# EAGLE design receiver_v2 (EAGLE 7.7.0)
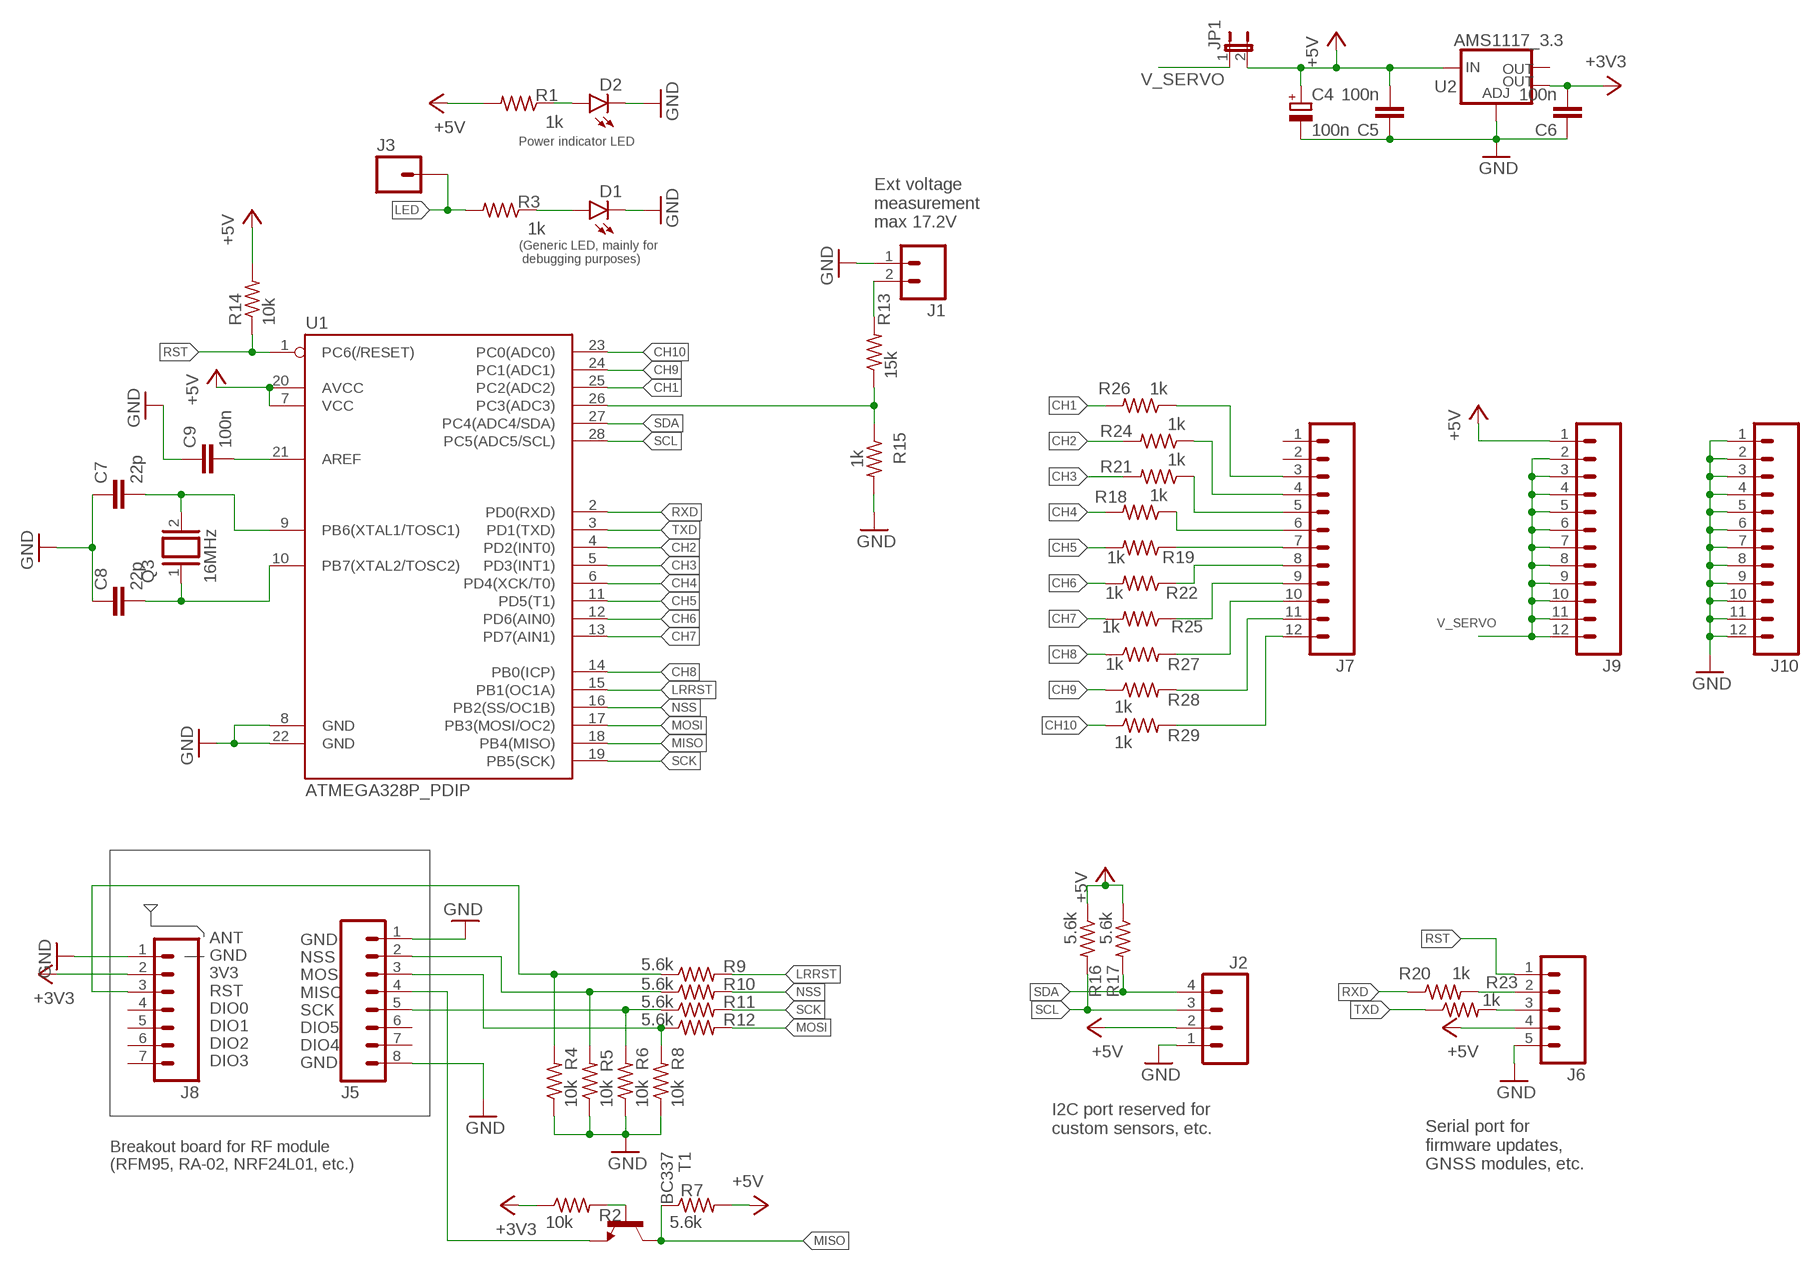
[diagram p0: schematic, sheet 1]

## Parts
C4  100n  CPOL-EUE2,5-6E  [E2,5-6E]
C5  100n  C-EU050-024X044  [C050-024X044]
C6  100n  C-EU050-024X044  [C050-024X044]
C7  22p  C-EU050-024X044  [C050-024X044]
C8  22p  C-EU050-024X044  [C050-024X044]
C9  100n  C-EU050-024X044  [C050-024X044]
D1  LED3MM  [LED3MM]
D2  LED3MM  [LED3MM]
J1  M02PTH  [1X02]
J2  M04PTH  [1X04]
J3  M01PTH  [1X01]
J5  M08  [1X08_ROUND]
J6  M05PTH  [1X05]
J7  M12PTH  [1X12]
J8  M07  [1X07]
J9  M12PTH  [1X12]
J10  M12PTH  [1X12]
JP1  JP1E  [JP1]
Q3  16MHz  XTAL/S  [QS]
R1  1k  R-US_0204/2V  [0204V]
R2  10k  R-US_0207/15  [0207/15]
R3  1k  R-US_0204/2V  [0204V]
R4  10k  R-US_0204/2V  [0204V]
R5  10k  R-US_0204/2V  [0204V]
R6  10k  R-US_0204/2V  [0204V]
R7  5.6k  R-US_0204/2V  [0204V]
R8  10k  R-US_0204/2V  [0204V]
R9  5.6k  R-US_0204/2V  [0204V]
R10  5.6k  R-US_0204/2V  [0204V]
R11  5.6k  R-US_0204/2V  [0204V]
R12  5.6k  R-US_0204/2V  [0204V]
R13  15k  R-US_0204/2V  [0204V]
R14  10k  R-US_0204/7  [0204/7]
R15  1k  R-US_0204/2V  [0204V]
R16  5.6k  R-US_0204/2V  [0204V]
R17  5.6k  R-US_0204/2V  [0204V]
R18  1k  R-US_0204/2V  [0204V]
R19  1k  R-US_0204/2V  [0204V]
R20  1k  R-US_0204/7  [0204/7]
R21  1k  R-US_0204/2V  [0204V]
R22  1k  R-US_0204/2V  [0204V]
R23  1k  R-US_0204/7  [0204/7]
R24  1k  R-US_0204/2V  [0204V]
R25  1k  R-US_0204/2V  [0204V]
R26  1k  R-US_0204/2V  [0204V]
R27  1k  R-US_0204/2V  [0204V]
R28  1k  R-US_0204/2V  [0204V]
R29  1k  R-US_0204/2V  [0204V]
T1  BC337  [TO92]
U1  ATMEGA328P_PDIP  [DIL28-3]
U2  AMS1117_3.3  V_REG_LM1117SOT223  [SOT223]

## Nets
+3V3: C6.2 J8.2 R2.1 U2.4(OUT)
+5V: C4.+ C5.2 J2.2 J6.4 J9.1 JP1.2 R1.2 R7.2 R14.2 R16.1 R17.1 U1.7(VCC) U1.20(AVCC) U2.3(IN)
CH1: R26.2 U1.25(PC2(ADC2))
CH2: R24.2 U1.4(PD2(INT0))
CH3: R21.2 U1.5(PD3(INT1))
CH4: R18.2 U1.6(PD4(XCK/T0))
CH5: R19.2 U1.11(PD5(T1))
CH6: R22.2 U1.12(PD6(AIN0))
CH7: R25.2 U1.13(PD7(AIN1))
CH8: R27.1 U1.14(PB0(ICP))
CH9: R28.1 U1.24(PC1(ADC1))
CH10: R29.1 U1.23(PC0(ADC0))
GND: C4.- C5.1 C6.1 C7.1 C8.1 C9.1 D1.K(C) D2.K(C) J1.1 J2.1 J5.1 J5.8 J6.5 J8.1 J10.1 J10.2 J10.3 J10.4 J10.5 J10.6 J10.7 J10.8 J10.9 J10.10 J10.11 J10.12 R4.1 R5.1 R6.1 R8.1 R15.2 U1.8(GND) U1.22(GND) U2.1(ADJ)
LED: J3.1 R3.2
LRRST: R9.2 U1.15(PB1(OC1A))
MISO: R7.1 T1.3(C) U1.18(PB4(MISO))
MOSI: R12.2 U1.17(PB3(MOSI/OC2))
N$1: D2.A R1.1
N$2: J7.11 R28.2
N$3: J5.4 T1.1(E)
N$4: J7.10 R27.2
N$6: J8.3 R4.2 R9.1
N$7: J5.2 R5.2 R10.1
N$8: J5.5 R6.2 R11.1
N$9: J5.3 R8.2 R12.1
N$10: C9.2 U1.21(AREF)
N$13: R13.1 R15.1 U1.26(PC3(ADC3))
N$14: J6.3 R23.2
N$15: D1.A R3.1
N$17: C7.2 Q3.2 U1.9(PB6(XTAL1/TOSC1))
N$18: J7.3 R26.1
N$19: C8.2 Q3.1 U1.10(PB7(XTAL2/TOSC2))
N$21: J6.2 R20.2
N$22: J7.4 R24.1
N$24: J7.5 R21.1
N$26: J7.6 R18.1
N$28: J7.7 R19.1
N$30: J7.8 R22.1
N$32: J7.9 R25.1
N$33: R2.2 T1.2(B)
N$35: J1.2 R13.2
N$40: J7.12 R29.2
NSS: R10.2 U1.16(PB2(SS/OC1B))
RST: J6.1 R14.1 U1.1(PC6(/RESET))
RXD: R20.1 U1.2(PD0(RXD))
SCK: R11.2 U1.19(PB5(SCK))
SCL: J2.3 R16.2 U1.28(PC5(ADC5/SCL))
SDA: J2.4 R17.2 U1.27(PC4(ADC4/SDA))
TXD: R23.1 U1.3(PD1(TXD))
V_SERVO: J9.2 J9.3 J9.4 J9.5 J9.6 J9.7 J9.8 J9.9 J9.10 J9.11 J9.12 JP1.1
Unconnected: J5.6 J5.7 J7.1 J7.2 J8.4 J8.5 J8.6 J8.7 U2.2(OUT)

## Notes on the sheet
- Power indicator LED
- Ext voltage 
  measurement
  max 17.2V
- (Generic LED, mainly for
   debugging purposes)
- ANT
  GND
  3V3
  RST
  DIO0
  DIO1
  DIO2
  DIO3
- GND
  NSS
  MOSI
  MISO
  SCK
  DIO5
  DIO4
  GND
- I2C port reserved for
  custom sensors, etc.
- Serial port for
  firmware updates,
  GNSS modules, etc.
- Breakout board for RF module
  (RFM95, RA-02, NRF24L01, etc.)

## Library data of the parts
C4 = rcl:CPOL-EU: POLARIZED CAPACITOR, European symbol
C5-C9 = rcl:C-EU: CAPACITOR, European symbol
D1 D2 = SparkFun-LED:LED: LEDs Standard schematic elements and footprints for 5mm, 3mm, 1206, and 0603 sized LEDs. 5mm - Spark Fun Electronics SKU : COM-00529 (and others); PROD_ID: DIO-08794
J1 = SparkFun-Connectors:M02: Standard 2-pin 0.1" header. Use with - straight break away headers ( PRT-00116) - right angle break away headers (PRT-00553) - swiss pins (PRT-00743) - machine pins (PRT-00117) - female headers (PRT-00115) Molex polarized connector foot print use with: PRT-08233 with associated crimp pins and housings. 2.54_SCREWTERM for use with PRT-10571. 3.5mm Screw Terminal footprints for PRT-08084 5mm Screw Terminal footprints for use with PRT-08432
J2 = SparkFun-Connectors:M04: Header 4 Standard 4-pin 0.1" header. Use with straight break away headers (SKU : PRT-00116), right angle break away headers (PRT-00553), swiss pins (PRT-00743), machine pins (PRT-00117), and female headers (PRT-00115). Molex polarized connector foot print use with SKU : PRT-08231 with associated crimp pins and housings. 1MM SMD Version SKU: PRT-10208; PROD_ID: CONN-09696
J3 = SparkFun-Connectors:M01: Header 1 Standard 1-pin 0.1" header. Use with straight break away headers (SKU : PRT-00116), right angle break away headers (PRT-00553), swiss pins (PRT-00743), machine pins (PRT-00117), and female headers (PRT-00115). SMTSO-256-ET is a "flush mount" nut for a 4-40 screw. The older package used to be too tight, and did not allow it to sit properly thru the drill hit. The latest (0.165DIA) fits nice and snug.
J5 = SparkFun-Connectors:M08: Header 8 Standard 8-pin 0.1" header. Use with straight break away headers (SKU : PRT-00116), right angle break away headers (PRT-00553), swiss pins (PRT-00743), machine pins (PRT-00117), and female headers (PRT-00115).; PROD_ID: CONN-08437
J6 = SparkFun-Connectors:M05: Header 5 Standard 5-pin 0.1" header. Use with straight break away headers (SKU : PRT-00116), right angle break away headers (PRT-00553), swiss pins (PRT-00743), machine pins (PRT-00117), and female headers (PRT-00115). Molex polarized connector foot print use with SKU : PRT-08230 with associated crimp pins and housings.
J7 J9 J10 = SparkFun-Connectors:M12: Header 12 Standard 12-pin 0.1" header. Use with straight break away headers (SKU : PRT-00116), right angle break away headers (PRT-00553), swiss pins (PRT-00743), machine pins (PRT-00117), and female headers (PRT-00115).
J8 = SparkFun-Connectors:M07: Header 7 Standard 7-pin 0.1" header. Use with straight break away headers (SKU : PRT-00116), right angle break away headers (PRT-00553), swiss pins (PRT-00743), machine pins (PRT-00117), and female headers (PRT-00115). NOTES ON THE VARIANTS LOCK and LOCK_LONGPADS... This footprint was designed to help hold the alignment of a through-hole component (i.e. 7-pin header) while soldering it into place. You may notice that each hole has been shifted either up or down by 0.005 of an inch from it's more standard position (which is usually a perfectly straight line). This slight alteration caused the pins (the squares in the middle) to touch the edges of the holes. Because they are alternating, it causes a "brace" to hold the header in place. 0.005 has proven to be the perfect amount of "off-center" position when using our standard breakaway headers. Although looks a little odd when you look at the bare footprint, once you have a header in there, the alteration is very hard to notice. Also, if you push a header all the way into place, it is covered up entirely on the bottom side. This idea of altering the position of holes to aid alignment will be further integrated into the Sparkfun Library for other footprints. It can help hold any component with 3 or more connection pins.
JP1 = jumper:JP1E: JUMPER
Q3 = special:XTAL/S: CRYSTAL
R1-R29 = rcl:R-US_: RESISTOR, American symbol
T1 = transistor:BC337: NPN TRANSISTOR
U1 = SparkFun-DigitalIC:ATMEGA328P_PDIP: uC used in the Arduino 32kb flash, 1k EEPROM, 2k SRAM This is the through-hole version of this chip.
U2 = SparkFun-PowerIC:V_REG_LM1117: Voltage Regulator LM1117 Standard adjustable voltage regulator but in SMD form. Spark Fun Electronics SKU : COM-00595; PROD_ID: VREG-08170

## Net classes
1 rf: clearance 0.5 mm

## Board
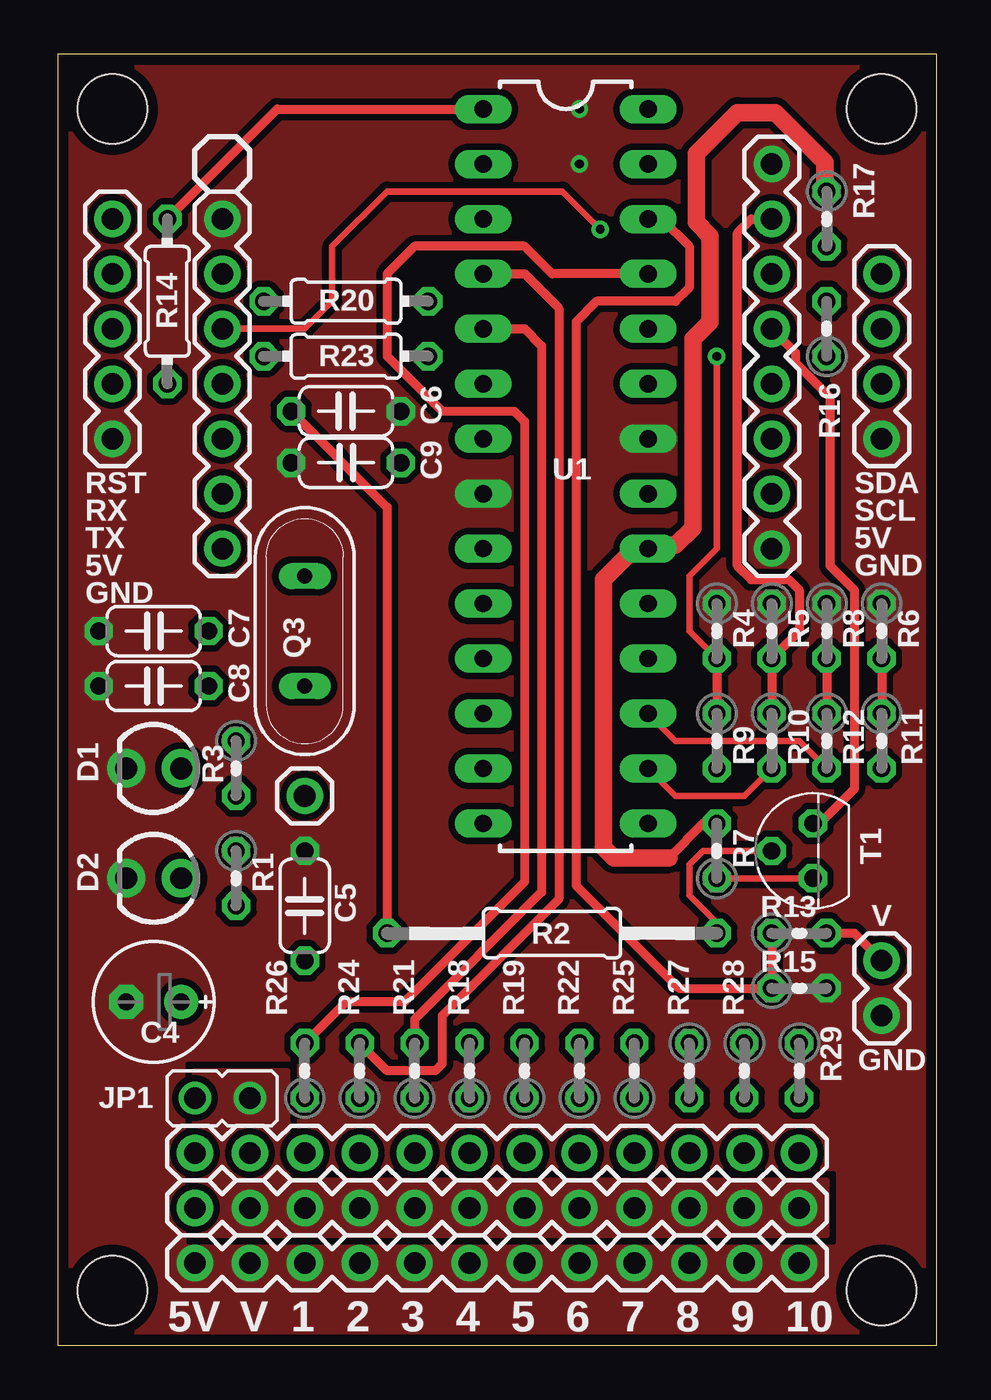
[diagram p1: board, top side]
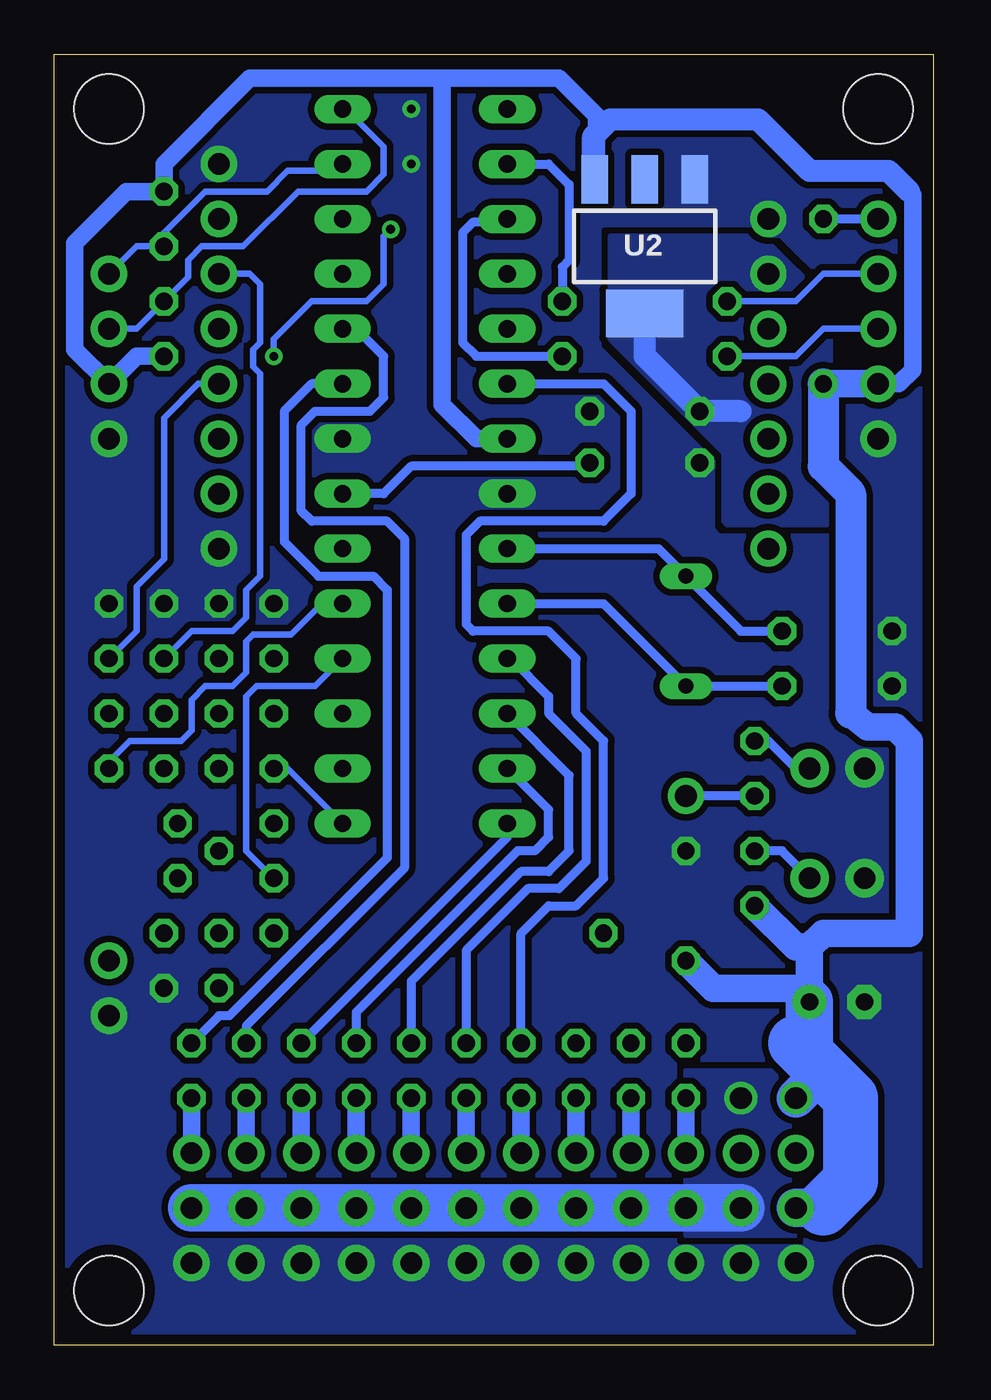
[diagram p2: board, bottom side, seen from below]

Size 40.64 x 59.69 mm. Coordinates in mm from the lower left corner, seen from the top.
Outline: 40.64,0 40.64,59.69 0,59.69 0,0 40.64,0
Copper layers (1*16): Top 0.035mm / dielectric 1.5mm / Bottom 0.035mm
Design rules "default *": minimum track width 10mil, minimum drill 0.4mm, track to track 0.3mm, track to pad 0.3mm, pad to pad 0.3mm, via to via 0.3mm, smd to smd 8mil, copper to edge 0.5mm, drill to drill 8mil, minimum pad ring 10mil, minimum via ring 8mil, stop-mask expansion 4mil, vias tented up to drill 0.8mm, thermal gap 10mil
Holes 3.2 mm at 2.54,57.15 38.1,57.15 2.54,2.54 38.1,2.54

### Footprints (pad centres in the part's own frame; a part is rotated, then mirrored left to right if it is on the bottom)
E2,5-6E = drill 0.8 pad 1.575: + -1.27,0 | drill 0.8 pad 1.575 octagon: - 1.27,0
C050-024X044 = drill 0.8 octagon: 1 -2.54,0; 2 2.54,0
LED3MM = drill 1 pad 1.778: A -1.27,0; K 1.27,0
1X02 = drill 1 pad 1.676: 1 0,0; 2 2.54,0
1X04 = drill 1 pad 1.676: 1 0,0; 2 2.54,0; 3 5.08,0; 4 7.62,0
1X01 = drill 1.016 pad 1.676: 1 0,0
1X08_ROUND = drill 1 pad 1.676: 1 0,0; 2 2.54,0; 3 5.08,0; 4 7.62,0; 5 10.16,0; 6 12.7,0; 7 15.24,0; 8 17.78,0
1X05 = drill 1 pad 1.676: 1 0,0; 2 2.54,0; 3 5.08,0; 4 7.62,0; 5 10.16,0
1X12 = drill 1 pad 1.676: 1 0,0; 2 2.54,0; 3 5.08,0; 4 7.62,0; 5 10.16,0; 6 12.7,0; 7 15.24,0; 8 17.78,0; 9 20.32,0; 10 22.86,0; 11 25.4,0; 12 27.94,0
1X07 = drill 1 pad 1.676: 1 0,0; 2 2.54,0; 3 5.08,0; 4 7.62,0; 5 10.16,0; 6 12.7,0; 7 15.24,0
JP1 = drill 1: 1 0,-1.27; 2 0,1.27
QS = drill 0.7 pad 1.016 long: 1 -2.54,0; 2 2.54,0
0204V = drill 0.8 octagon: 1 -1.27,0; 2 1.27,0
0207/15 = drill 0.8 octagon: 1 -7.62,0; 2 7.62,0
0204/7 = drill 0.8 octagon: 1 -3.81,0; 2 3.81,0
TO92 = drill 0.8 octagon: 1 1.27,0; 2 0,1.905; 3 -1.27,0
DIL28-3 = drill 0.8 long: 1 -16.51,-3.81; 2 -13.97,-3.81; 3 -11.43,-3.81; 4 -8.89,-3.81; 5 -6.35,-3.81; 6 -3.81,-3.81; 7 -1.27,-3.81; 8 1.27,-3.81; 9 3.81,-3.81; 10 6.35,-3.81; 11 8.89,-3.81; 12 11.43,-3.81; 13 13.97,-3.81; 14 16.51,-3.81; 15 16.51,3.81; 16 13.97,3.81; 17 11.43,3.81; 18 8.89,3.81; 19 6.35,3.81; 20 3.81,3.81; 21 1.27,3.81; 22 -1.27,3.81; 23 -3.81,3.81; 24 -6.35,3.81; 25 -8.89,3.81; 26 -11.43,3.81; 27 -13.97,3.81; 28 -16.51,3.81
SOT223 = smd 1.219 x 2.235: 1 -2.311,-3.099; 2 0,-3.099; 3 2.311,-3.099 | smd 3.6 x 2.2: 4 0,3.099

### Placement (x,y rotation side)
C4  4.45,15.88 180 top
C5  11.43,20.32 270 top
C6  13.34,43.18 180 top
C7  4.45,33.02 0 top
C8  4.45,30.48 0 top
C9  13.34,40.8 0 top
D1  4.45,26.67 180 top
D2  4.45,21.59 180 top
J1  38.1,15.24 90 top
J2  38.1,41.91 90 top
J3  11.43,25.4 0 top
J5  33.02,54.61 270 top
J6  2.54,52.07 270 top
J7  6.35,8.89 0 top
J8  7.62,52.07 270 top
J9  6.35,6.35 0 top
J10  6.35,3.81 0 top
JP1  7.62,11.43 90 top
Q3  11.43,33.02 90 top
R1  8.26,21.59 270 top
R2  22.86,19.05 0 top
R3  8.26,26.67 270 top
R4  30.48,33.02 270 top
R5  33.02,33.02 270 top
R6  38.1,33.02 270 top
R7  30.48,22.86 90 top
R8  35.56,33.02 270 top
R9  30.48,27.94 270 top
R10  33.02,27.94 270 top
R11  38.1,27.94 270 top
R12  35.56,27.94 270 top
R13  34.29,19.05 0 top
R14  5.08,48.26 270 top
R15  34.29,16.51 0 top
R16  35.56,46.99 90 top
R17  35.56,52.07 270 top
R18  19.05,12.7 90 top
R19  21.59,12.7 90 top
R20  13.34,48.26 180 top
R21  16.51,12.7 90 top
R22  24.13,12.7 90 top
R23  13.34,45.72 180 top
R24  13.97,12.7 90 top
R25  26.67,12.7 90 top
R26  11.43,12.7 90 top
R27  29.21,12.7 270 top
R28  31.75,12.7 270 top
R29  34.29,12.7 270 top
T1  34.92,22.86 90 top
U1  23.5,40.64 270 top
U2  13.34,50.8 180 bottom

### Tracks (layer width: path | path; a pad name or v marks a point on that pad's centre or on a via)
+3V3
  Top 0.406: C6.2 15.24,38.73 R2.1
  Bottom 1.016: 8.89,43.18 C6.2 13.34,45.72 U2.4
  pour Bottom (isolate 0.305, no thermals): 7.94,51.28 14.92,51.28 14.92,46.51 9.68,41.27 9.68,38.1 9.53,37.94 4.92,37.94 4.6,38.26 4.6,44.61 4.76,44.77 4.76,48.1
+5V
  Top 0.406: R7.2 29.84,24.13 28.26,22.54
  Top 0.813: R17.1 35.48,53.42 35.48,54.69 33.18,56.99 31.43,56.99 29.53,55.09 29.53,51.91 30.16,51.28 30.16,47.31 29.37,46.51 29.37,37.78 28.57,36.99 27.46,36.99 U1.20 26.67,36.83 25.24,35.4 25.24,23.02 25.72,22.54 28.26,22.54
  Bottom 0.813: 1.11,53.34 0.95,53.18 0.95,45.09 1.59,44.45 J6.4 | U2.3 15.56,53.99 15.56,56.83 17.3,58.58 22.7,58.58 | 22.7,58.58 22.7,43.5 21.11,41.91 U1.7 | R16.1 36.83,45.72 J2.2 39.69,46.04 39.69,50.96 37.31,53.34 R17.1 35.56,54.61 31.59,58.58 22.7,58.58
  Bottom 1.016: U2.3 15.72,53.97 15.72,55.88 14.92,56.67 8.1,56.67 5.71,54.29 2.06,54.29 1.11,53.34
  Bottom 1.27: R14.2 J6.4 | 3.81,29.21 3.02,28.57 1.75,28.57 1.11,27.94 1.11,19.05 5.08,19.05 5.71,18.41 | 5.71,18.41 5.71,16.51 | 5.71,16.51 C4.+ | R1.2 6.35,18.41 5.71,18.41 | C5.2 10.16,16.51 5.71,16.51
  Bottom 1.422: R14.2 5.08,40.64 3.81,39.37 3.81,29.21
  Bottom 1.778: J9.1 5.08,6.35 | JP1.2 5.08,12.7 | 6.35,13.97 5.71,13.97
  Bottom 2.184: 5.71,13.97 C4.+
  Bottom 2.54: 5.08,6.35 3.81,7.62 3.81,11.43 5.08,12.7 6.35,13.97
CH1
  Top 0.406: U1.25 22.86,49.53 21.59,50.8 16.51,50.8 15.24,49.53 15.24,45.72 17.78,43.18 21.11,43.18 21.59,42.7 21.59,21.43 16.03,15.88 13.34,15.88 R26.2
CH2
  Top 0.406: U1.4 21.59,49.53 23.18,47.94 23.18,20.64 17.78,15.24 17.78,13.02 17.46,12.7 15.24,12.7 R24.2
CH3
  Top 0.406: U1.5 21.59,46.99 22.38,46.2 22.38,20.95 16.51,15.08 R21.2
CH4
  Bottom 0.406: R18.2 19.05,19.05 17.78,20.32 16.51,20.32 15.24,21.59 15.24,27.94 16.51,29.21 16.51,31.75 17.78,33.02 21.27,33.02 21.59,33.34 21.59,37.47 20.95,38.1 15.24,38.1 13.97,39.37 13.97,43.18 15.24,44.45 U1.6
CH5
  Bottom 0.406: U1.11 19.53,31.75 17.78,30 17.78,29.21 16.03,27.46 16.03,22.38 17.3,21.11 18.73,21.11 21.59,18.26 R19.2
CH6
  Bottom 0.406: U1.12 16.83,26.35 16.83,22.86 17.78,21.91 19.05,21.91 24.13,16.83 R22.2
CH7
  Bottom 0.406: U1.13 17.78,24.77 17.78,23.5 18.41,22.86 19.21,22.86 26.67,15.4 R25.2
CH8
  Bottom 0.406: R27.1 19.68,23.5 U1.14
CH9
  Bottom 0.406: U1.24 26.67,46.99 25.4,45.72 25.4,43.81 26.04,43.18 28.57,43.18 29.21,42.55 29.21,38.58 28.73,38.1 25.24,38.1 24.45,37.31 24.45,22.07 31.75,14.76 R28.1
CH10
  Bottom 0.406: R29.1 33.02,15.24 32.54,15.24 25.24,22.54 25.24,34.92 25.88,35.56 28.42,35.56 30,37.15 30,43.18 28.73,44.45 U1.23
GND  (via drill 0.4)
  other vias: 24.13,54.61 24.13,57.15
  pour Bottom (rank 3, no thermals): 0,59.69 40.64,59.69 40.64,0 0,0 0,2.54
  pour Top (isolate 0.305, rank 3, no thermals): 0,59.69 40.64,59.69 40.64,0 0,0
LED
  Bottom 0.406: R3.2 J3.1
LRRST
  Bottom 0.305: U1.15 29.84,26.67 R9.2
MISO
  Top 0.305: T1.3 R7.1
  Bottom 0.305: U1.18 28.57,30.48 31.27,30.48 31.75,30 31.75,22.86 R7.1
MOSI
  Top 0.305: U1.17 28.57,27.94 34.29,27.94 R12.2
N$1
  Bottom 0.406: D2.A 6.99,22.86 R1.1
N$2
  Bottom 0.813: J7.11 R28.2
N$3
  Top 0.406: T1.1 35.24,24.13 36.83,25.72 36.83,34.92 35.72,36.04 35.72,43.81 34.13,45.4 34.13,45.88 J5.4
N$4
  Bottom 0.813: J7.10 R27.2
N$6  (via drill 0.4)
  Top 0.305: J8.3 11.43,46.99 12.7,48.26 12.7,50.8 15.24,53.34 23.34,53.34 v25.08,51.59 | R4.2 29.21,33.02 29.21,35.56 30.48,36.83 v30.48,45.72
  Top 0.406: R4.2 R9.1
  Bottom 0.305: v30.48,45.72 30.48,46.51 28.73,48.26 26.19,48.26 25.4,49.05 25.4,51.28 v25.08,51.59
N$7
  Top 0.406: R10.1 R5.2 34.29,33.02 34.29,34.92 33.81,35.4 32.07,35.4 31.43,36.04 31.43,51.44 32.07,52.07 J5.2
N$8
  Top 0.406: R6.2 R11.1
  Bottom 0.305: R6.2 36.83,33.02 36.83,35.08 35.56,36.35 35.56,42.86 33.97,44.45 J5.5
N$9
  Top 0.406: R8.2 R12.1
  Bottom 0.305: R8.2 34.29,33.02 32.38,33.02 31.75,33.66 31.75,34.92 31.11,35.56 31.11,44.93 31.43,45.24 31.43,46.04 31.11,46.35 31.11,49.05 31.59,49.53 J5.3
N$10
  Bottom 0.406: C9.2 16.03,40.64 24.13,40.64 25.4,39.37 U1.21
N$13
  Top 0.406: R13.1 R15.1 28.73,16.51 23.97,21.27 23.97,47.31 24.92,48.26 28.57,48.26 29.21,48.9 29.21,50.8 27.94,52.07 U1.26
N$14
  Bottom 0.305: R23.2 6.35,45.72 5.08,46.99 J6.3
N$15
  Bottom 0.406: R3.1 7.62,27.94 6.35,26.67 D1.A
N$17
  Bottom 0.406: 7.62,33.02 C7.2 8.89,33.02 Q3.2 12.7,36.83 U1.9
N$18
  Bottom 0.813: J7.3 R26.1
N$19
  Bottom 0.406: C8.2 Q3.1 15.24,34.29 U1.10
N$21
  Bottom 0.305: R20.2 6.35,48.26 5.08,49.53 J6.2
N$22
  Bottom 0.813: J7.4 R24.1
N$24
  Bottom 0.813: J7.5 R21.1
N$26
  Bottom 0.813: J7.6 R18.1
N$28
  Bottom 0.813: J7.7 R19.1
N$30
  Bottom 0.813: J7.8 R22.1
N$32
  Bottom 0.813: J7.9 R25.1
N$33
  Top 0.305: T1.2 29.84,22.86 29.21,22.23 29.21,20.8 30.48,19.53 R2.2
N$35
  Top 0.406: J1.2 36.83,19.05 R13.2
N$40
  Bottom 0.813: J7.12 R29.2
NSS
  Top 0.305: U1.16 28.57,25.4 31.75,25.4 R10.2
RST
  Top 0.406: R14.1 10.16,57.15 U1.1
  Bottom 0.406: J6.1 R14.1
RXD
  Bottom 0.406: U1.2 17.78,54.61 16.83,53.66 16.83,50.16 17.14,49.85 R20.1
SCK
  Bottom 0.305: U1.19 28.26,34.29 29.69,32.86 31.43,32.86 31.75,32.54 31.75,31.11 32.38,30.48 33.66,30.48 34.29,29.84 34.29,28.42 34.77,27.94 37.15,27.94 38.1,26.99 R11.2
SCL
  Bottom 0.305: J2.3 36.83,46.99 R16.2 34.45,49.37 34.45,50.16 33.81,50.8 31.91,50.8 29.37,53.34 26.19,53.34 25.4,54.13 25.4,55.4 27.15,57.15 U1.28
SDA
  Bottom 0.305: U1.27 27.62,54.29 29.84,54.29 30.8,53.34 33.66,53.34 35.56,51.44 R17.2 36.83,50.8 J2.4
TXD
  Bottom 0.406: U1.3 19.84,51.91 21.27,51.91 21.75,51.44 21.75,46.35 21.11,45.72 R23.1
V_SERVO
  Bottom 2.184: J9.12 J9.11 J9.10 J9.9 J9.8 J9.7 J9.6 J9.5 J9.4 J9.3 J9.2
  pour Top (isolate 0.305, no thermals): 6.35,12.7 10.64,12.7 10.64,7.62 35.56,7.62 35.56,5.08 6.35,5.08
  pour Bottom (isolate 0.305, no thermals): 6.35,12.7 11.43,12.7 11.43,5.08 7.62,5.08 6.35,5.08 6.35,6.35

### Text on the board
tPlace: 5V | V | 1 | 2 | 3 | 4 | 5 | 6 | 7 | 8 | 9 | 10
tNames: RST | SDA | RX | SCL | TX | 5V | 5V | GND | GND | V | GND